# EAGLE design Adafruit QT Py ESP32-S2 uFL (EAGLE 9.6.2)
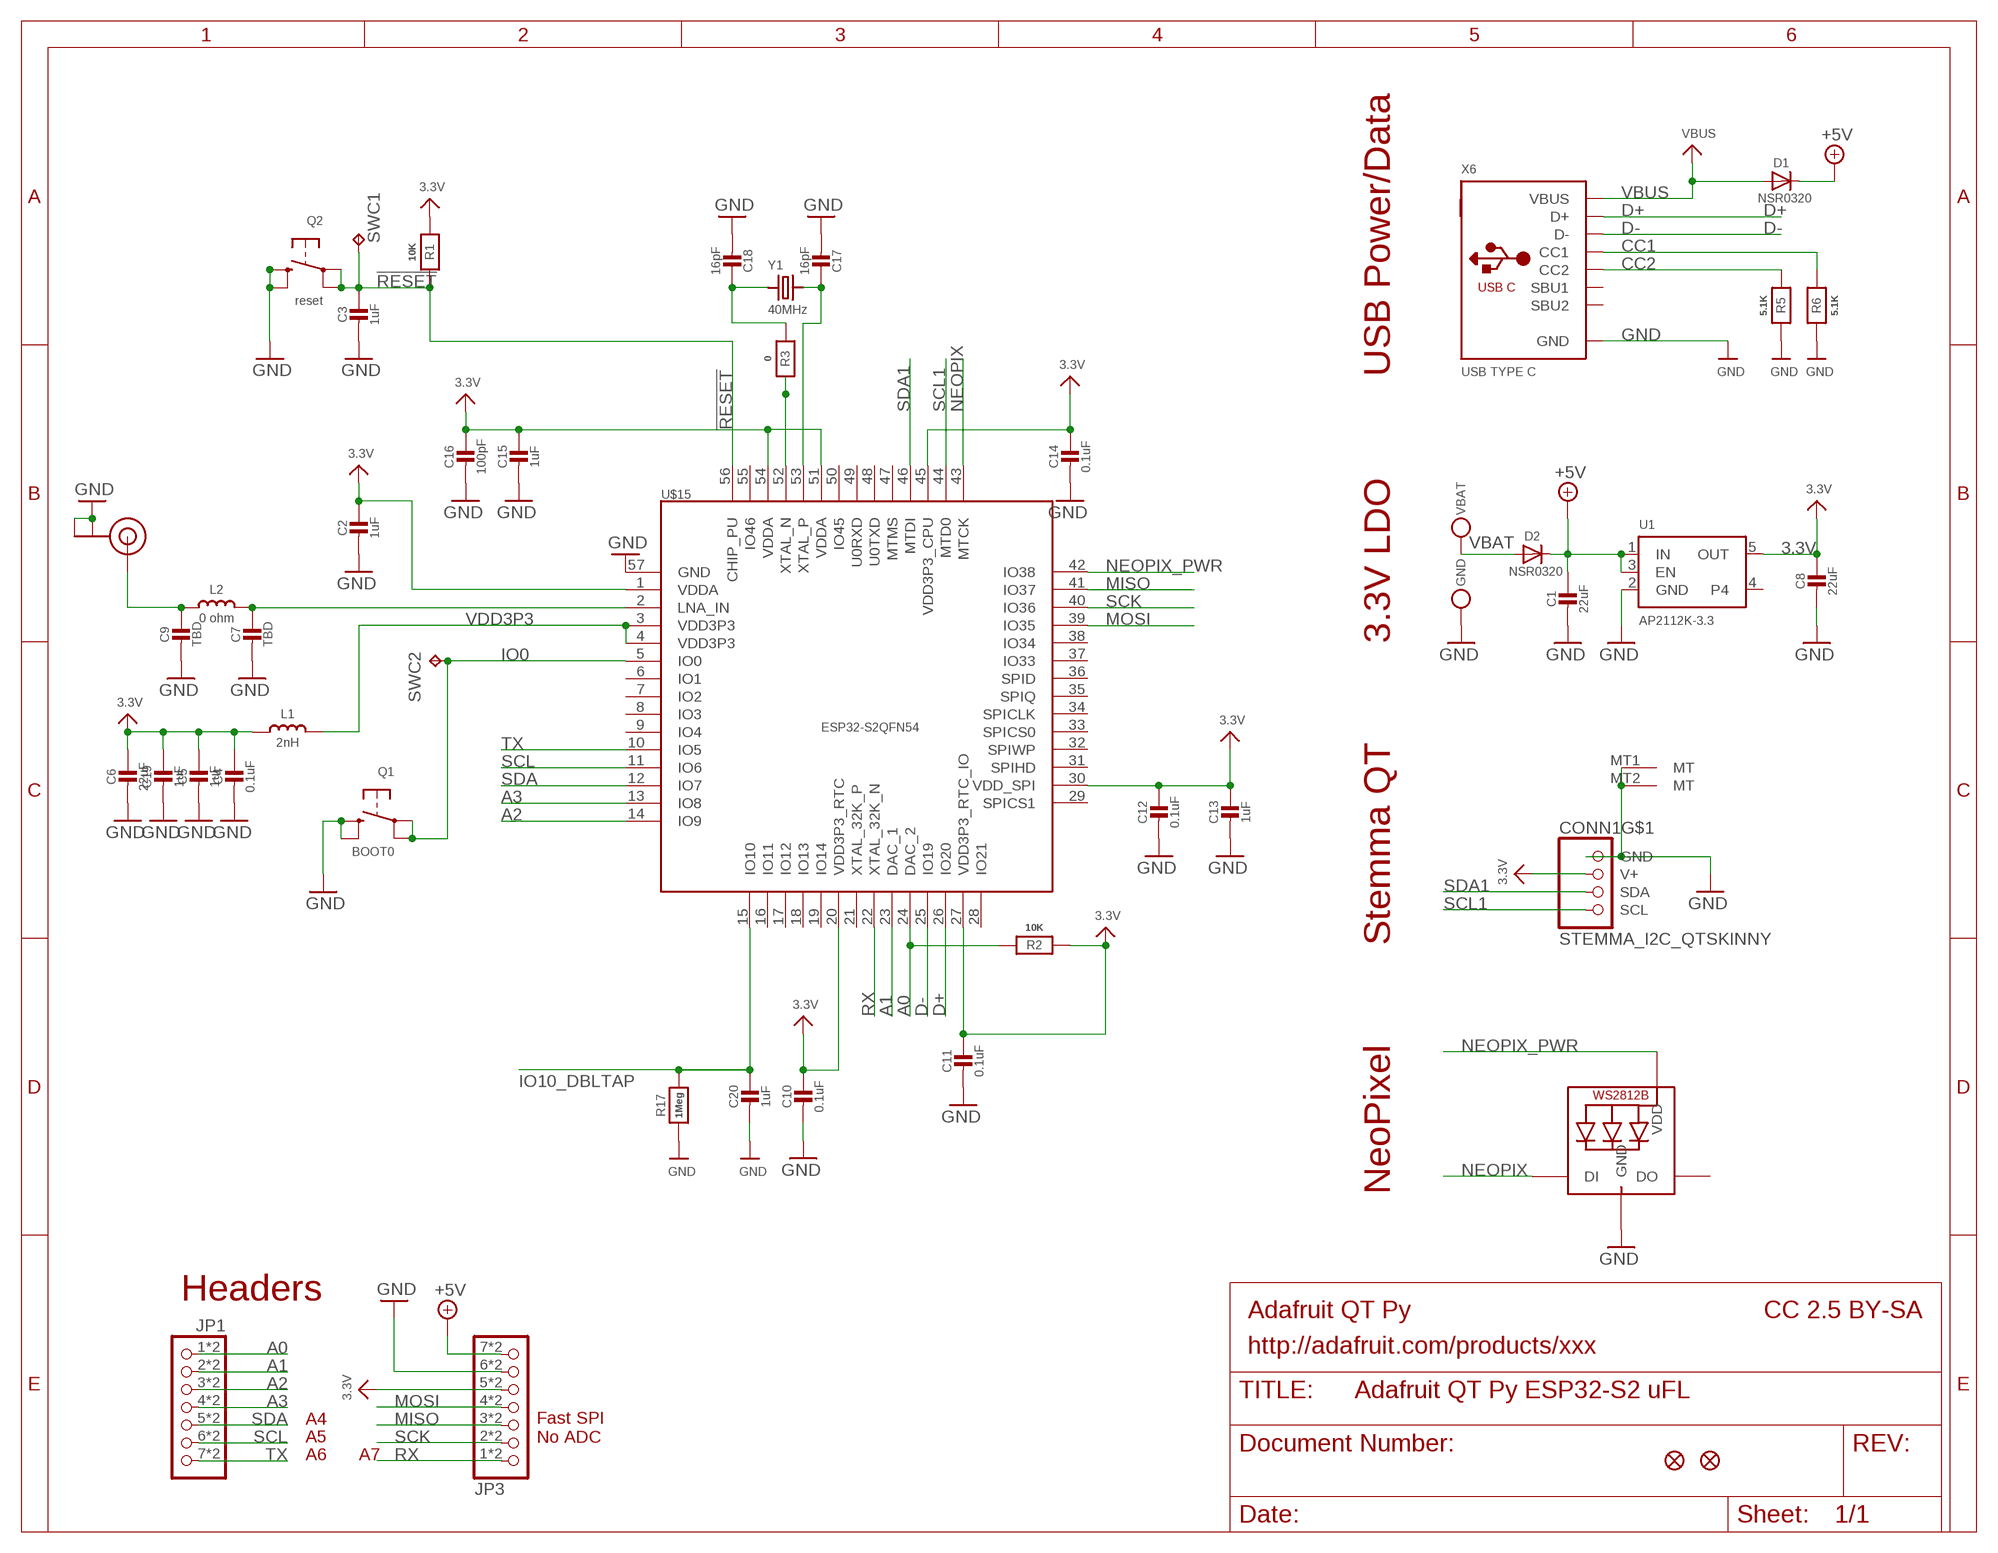
[diagram p0: schematic, sheet 1]

## Parts
C1  22uF  CAP_CERAMIC0805-NOOUTLINE  [0805-NO]
C2  1uF  CAP_CERAMIC_0402NO  [_0402NO]
C3  1uF  CAP_CERAMIC_0402NO  [_0402NO]
C4  0.1uF  CAP_CERAMIC_0402NO  [_0402NO]
C5  1uF  CAP_CERAMIC_0402NO  [_0402NO]
C6  22uF  CAP_CERAMIC0805-NOOUTLINE  [0805-NO]
C7  TBD  CAP_CERAMIC_0402NO  [_0402NO]
C8  22uF  CAP_CERAMIC0805-NOOUTLINE  [0805-NO]
C9  TBD  CAP_CERAMIC_0402NO  [_0402NO]
C10  0.1uF  CAP_CERAMIC_0402NO  [_0402NO]
C11  0.1uF  CAP_CERAMIC_0402NO  [_0402NO]
C12  0.1uF  CAP_CERAMIC_0402NO  [_0402NO]
C13  1uF  CAP_CERAMIC_0402NO  [_0402NO]
C14  0.1uF  CAP_CERAMIC_0402NO  [_0402NO]
C15  1uF  CAP_CERAMIC_0402NO  [_0402NO]
C16  100pF  CAP_CERAMIC_0402NO  [_0402NO]
C17  16pF  CAP_CERAMIC_0402NO  [_0402NO]
C18  16pF  CAP_CERAMIC_0402NO  [_0402NO]
C19  1uF  CAP_CERAMIC_0402NO  [_0402NO]
C20  1uF  CAP_CERAMIC_0402NO  [_0402NO]
CONN1  STEMMA_I2C_QTSKINNY  [JST_SH4_SKINNY]
D1  NSR0320  DIODE_SOD323MINI  [SOD-323_MINI]
D2  NSR0320  DIODE_SOD323MINI  [SOD-323_MINI]
GND  TESTPOINT_1X3  [TESTPOINT_RECT_1X3MM]
JP1  HEADER-1X7_CASTEL  [1X07_CASTEL]
JP3  HEADER-1X7_CASTEL  [1X07_CASTEL]
L1  2nH  INDUCTOR_0402  [_0402]
L2  0 ohm  INDUCTOR_0402  [_0402]
LED1  WS2812B_SK6805_1515  [SK6805_1515]
Q1  BOOT0  SWITCH_TACT_SMT4.6X2.8  [BTN_KMR2_4.6X2.8]
Q2  reset  SWITCH_TACT_SMT4.6X2.8  [BTN_KMR2_4.6X2.8]
R1  10K  RESISTOR_0402NO  [_0402NO]
R2  10K  RESISTOR_0402NO  [_0402NO]
R3  0  RESISTOR_0402NO  [_0402NO]
R5  5.1K  RESISTOR_0402NO  [_0402NO]
R6  5.1K  RESISTOR_0402NO  [_0402NO]
R17  1Meg  RESISTOR_0402NO  [_0402NO]
SWC1  TPB1,27  [B1,27]
SWC2  TPB1,27  [B1,27]
U1  AP2112K-3.3  VREG_SOT23-5  [SOT23-5]
U$6  FIDUCIAL_1MM  [FIDUCIAL_1MM]
U$8  FIDUCIAL_1MM  [FIDUCIAL_1MM]
U$11  U.FL  [U.FL]
U$15  ESP32-S2QFN54  [QFN40P700X700X90-57T400N]
VBAT  TESTPOINT_1X3  [TESTPOINT_RECT_1X3MM]
X6  USB TYPE C  USB_C  [USB_C_CUSB31-CFM2AX-01-X]
Y1  40MHz  CRYSTAL_2X1.6MM  [CRYSTAL_2X1.6]

## Nets
3.3V [power]: C2.1 C4.1 C5.1 C6.1 C8.1 C10.1 C11.1 C12.1 C13.1 C14.1 C15.1 C16.1 C19.1 CONN1.2(V+) JP3.5 JP3.5C L1.1 R1.1 R2.1 U1.5(OUT) U$15.1(VDDA) U$15.20(VDD3P3_RTC) U$15.27(VDD3P3_RTC_IO) U$15.30(VDD_SPI) U$15.45(VDD3P3_CPU) U$15.51(VDDA) U$15.54(VDDA)
!RESET: C3.1 Q2.A'(P1) Q2.A(P) R1.2 SWC1.TP U$15.56(CHIP_PU)
+5V [power]: C1.1 D1.C D2.C JP3.7 JP3.7C U1.1(IN) U1.3(EN)
A0: JP1.1 JP1.1C R2.2 U$15.24(DAC_2)
A1: JP1.2 JP1.2C U$15.23(DAC_1)
A2: JP1.3 JP1.3C U$15.14(IO9)
A3: JP1.4 JP1.4C U$15.13(IO8)
CC1: R6.2 X6.A5(CC1)
CC2: R5.2 X6.B5(CC2)
D+: U$15.26(IO20) X6.A6(D+) X6.B6(D+)
D-: U$15.25(IO19) X6.A7(D-) X6.B7(D-)
GND [power]: C1.2 C2.2 C3.2 C4.2 C5.2 C6.2 C7.2 C8.2 C9.2 C10.2 C11.2 C12.2 C13.2 C14.2 C15.2 C16.2 C17.2 C18.2 C19.2 C20.2 CONN1.1(GND) CONN1.MT1(MT) CONN1.MT2(MT) GND.P$1 JP3.6 JP3.6C LED1.4(GND) Q1.B'(S1) Q1.B(S) Q2.B'(S1) Q2.B(S) R5.1 R6.1 R17.1 U1.2(GND) U$11.P$1(GND) U$11.P$2(GND) U$15.57(GND) X6.A1B12(GND) X6.B1A12(GND)
IO0: Q1.A'(P1) Q1.A(P) SWC2.TP U$15.5(IO0)
IO10_DBLTAP: C20.1 R17.2 U$15.15(IO10)
MISO: JP3.3 JP3.3C U$15.41(IO37)
MOSI: JP3.4 JP3.4C U$15.39(IO35)
N$2: C7.1 L2.2 U$15.2(LNA_IN)
N$3: C9.1 L2.1 U$11.P$3(SIGNAL)
N$5: R3.2 U$15.52(XTAL_N)
N$6: C17.1 U$15.53(XTAL_P) Y1.3
N$7: C18.1 R3.1 Y1.1
NEOPIX: LED1.1(DI) U$15.43(MTCK)
NEOPIX_PWR: LED1.2(VDD) U$15.42(IO38)
RX: JP3.1 JP3.1C U$15.22(XTAL_32K_N)
SCK: JP3.2 JP3.2C U$15.40(IO36)
SCL: JP1.6 JP1.6C U$15.11(IO6)
SCL1: CONN1.4(SCL) U$15.44(MTD0)
SDA: JP1.5 JP1.5C U$15.12(IO7)
SDA1: CONN1.3(SDA) U$15.46(MTDI)
TX: JP1.7 JP1.7C U$15.10(IO5)
VBAT: D2.A VBAT.P$1
VBUS [power]: D1.A X6.A4B9(VBUS) X6.B4A9(VBUS)
VDD3P3: L1.2 U$15.3(VDD3P3) U$15.4(VDD3P3)
Unconnected: LED1.3(DO) U1.4 U$15.6(IO1) U$15.7(IO2) U$15.8(IO3) U$15.9(IO4) U$15.16(IO11) U$15.17(IO12) U$15.18(IO13) U$15.19(IO14) U$15.21(XTAL_32K_P) U$15.28(IO21) U$15.29(SPICS1) U$15.31(SPIHD) U$15.32(SPIWP) U$15.33(SPICS0) U$15.34(SPICLK) U$15.35(SPIQ) U$15.36(SPID) U$15.37(IO33) U$15.38(IO34) U$15.47(MTMS) U$15.48(U0TXD) U$15.49(U0RXD) U$15.50(IO45) U$15.55(IO46) X6.A8(SBU1) X6.B8(SBU2)

## Notes on the sheet
- USB Power/Data
- 3.3V LDO
- Stemma QT
- NeoPixel
- Headers
- Adafruit QT Py | CC 2.5 BY-SA
- http://adafruit.com/products/xxx
- A4
- A5
- Fast SPI
  No ADC
- A6 | A7

## Library data of the parts
C1-C20 = microbuilder:CAP_CERAMIC: Ceramic Capacitors For new designs, use the packages preceded by an '_' character since they are more reliable: The following footprints should be used on most boards: _0402 - Standard footprint for regular board layouts _0603 - Standard footprint for regular board layouts _0805 - Standard footprint for regular board layouts _1206 - Standard footprint for regular board layouts For extremely tight-pitch boards where space is at a premium, the following 'micro-pitch' footprints can be used (smaller pads, no silkscreen outline, etc.): _0402MP - Micro-pitch footprint for very dense/compact boards _0603MP - Micro-pitch footprint for very dense/compact boards _0805MP - Micro-pitch footprint for very dense/compact boards _1206MP - Micro-pitch footprint for very dense/compact boards
CONN1 = microbuilder:STEMMA_I2C
D1 D2 = microbuilder:DIODE: Diode SMA Model Volts Amps Type Vf Ir Digikey # Notes SSA34-E3 40V 3A Schottky 480mV @ 3A 200uA @ 40V SSA34-E3/61TGITR-ND CDBA120-G 20V 1A Schottky 500mV @ 1A 500uA @ 20V 641-1014-6-ND REEL MBRA210 10V 2A Schottky 350mV @ 2A 700uA @ 10V MBRA210LT3 SOD-123 Model Volts Amps Type Vf Ir Order # Notes BAT54T1G 30V 200mA Schottky 800mV @ 200mA 2uA @ 25V BAT54T1GOSTR-ND B0530W 30V 500mA Schottky 430mV @ 500mA 130uA @ 30V B0530W-FDICT-ND REEL MBR120 20V 1A Schottky 340mV @ 1A MBR120VLSFT1GOSCT-ND SOD-323 Model Volts Amps Type Vf Ir Order # Notes PMEG2005EJ 20V 500mA Schottky 355mV @ 500mA 568-4110-1-ND ZLLS410 10V 570mA Schottky 380mV @ 570mA ZLLS410CT-ND 1N4148WS 75V 150mA Silicon/Simple 1V 1N4148WSFSCT-ND REEL SOD-523 Model Volts Amps Type Vf Ir Order # Notes BAT54XV2 30V 200mA Schottky 0.8V @ 100mA BAT54XV2CT-ND TB751S 30V 30mA Schottky RB751S-40TE61CT-ND SOT23-R/W (R = Solder Paste/Reflow Ovens, W = Hand-Soldering) Model Volts Amps Type Vf Ir Order # Notes BAT54FILM 40V 300mA Schottky 497-7162-1-ND POWERDI-5 Model Volts Amps Type Vf Ir Order # Notes PDS560 60V 5A Schottky 670mV @ 5A 150uA @ 60V PDS560DICT-ND
GND VBAT = microbuilder:TESTPOINT: Test Point Various test points for characterisation and PCB testing TESTPOINT_SMT - Compact Surface Mount Test Point [Digikey: 5016KTR-ND]
JP1 JP3 = microbuilder:HEADER-1X7: PIN HEADER
L1 L2 = microbuilder:INDUCTOR: Inductors 0603: 10nH Ceramic Inductor - microwire antenna/RF (Digikey: 712-1434-2-ND) 0805: 560nH Ceramic Inductor - RF (Digikey: 553-1047-1-ND) 270nH Ceramic Inductor - Q = 40@250MHz, +-5%, 1 Ohm DC Resistance (Digikey: 535-10506-2-ND) 1007 (2518 Metric) SMT: 10µH 10% 250mOhm 820mA 1007 Inductor (Digikey: 587-2189-1-ND) 22µH 10% 500mOhm 580mA 1007 Inductor (Digikey: 587-2190-1-ND) 47µH 10% 950mOhm 420mA 1007 Inductor (Digikey: 587-2191-1-ND) 47µH 5% 100mOhm 1A 1008 Inductor (Digikey: 732-1816-1-ND) 5.0x5.0mm (Taiyo Yuden NR5040 Series) 6.8µH 20% 2.3A 64mOhm Inductor (Digikey: 587-2374-2-ND) 5.0x5.0mm (TDK VLC5045 Series) 4.7µH 20% 3.3A 34mOhm Inductor (Digikey: 445-6526-1-ND) 6.8µH 20% 2.7A 46mOhm Inductor (Digikey: 445-6527-1-ND) 6.0x6.0mm (TDK VLC6045 Series) 4.7µH 20% 3.8A 27mOhm Inductor (Digikey: 445-6538-2-ND) 6.8µH 20% 3A 41mOhm Inductor (Digikey: 445-6540-1-ND) 6.2µH 30% 2.2A 45mOhm Inductor (Digikey: SRR5028-6R2YCT-ND) - Not TDK VLC6045 but footprint should match 6.0x6.0mm (TDK SLF6045 Series) 6.8uH 30% 2A 33mOhm Inductor (Digikey: 445-4572-1-ND, Mouser: 810-SLF645T6R8N2R0PF) 6.0x6.0mm (Sumida CDRH5D28 Series) 6.2uH 30% 1.8A 45mOhm Inductor (Digikey: 308-1542-1-ND) Taiyo Yuden NR3015T2R2M - 2.2uH 20% 1.5A (Digikey: 587-1648-2-ND, Mouser: 963-NR3015T2R2M) - Used with TI TPS62172 CoilCraft RFID Transponder Coil - MA5532-AE (For use with AS3935 Lightning Sensor) Taiyo Yuden NRH2412T2R2MNGH - 2.2uH 20% 1AA (Digikey: 587-3443-1-ND) - Used with TI LM3671 Vishay IHLP 1.0uH Molded Inductor - 24mOhm DCR, 5A, +/-20%, -55°C-125°C (Digikey: 541-1319-1-ND)
LED1 = microbuilder:WS2812B
Q1 Q2 = microbuilder:SWITCH_TACT_SMT: SMT Tact Switches 6x6mm - Digikey: P12940SCT-ND KMR2 (4.6x2.8mm) - Digikey: 401-1426-1-ND EVQ-PQHB55 - Light Touch, 160GF (4.5x4.5mm) - Digikey: P8090SCT-ND KMT0 - KMT021 NGJ LHS (etc.) IP68/Waterproof - Digikey: CKN10289CT-ND
R1-R3 R5 R6 R17 = microbuilder:RESISTOR: Resistors For new designs, use the packages preceded by an '_' character since they are more reliable: The following footprints should be used on most boards: _0402 - Standard footprint for regular board layouts _0603 - Standard footprint for regular board layouts _0805 - Standard footprint for regular board layouts _1206 - Standard footprint for regular board layouts For extremely tight-pitch boards where space is at a premium, the following 'micro-pitch' footprints can be used (smaller pads, no silkscreen outline, etc.): _0402MP - Micro-pitch footprint for very dense/compact boards _0603MP - Micro-pitch footprint for very dense/compact boards _0805MP - Micro-pitch footprint for very dense/compact boards _1206MP - Micro-pitch footprint for very dense/compact boards
SWC1 SWC2 = testpad:TP: Test pad
U1 = adafruit_power:VREG_SOT23-5: SOT23-5 Fixed Voltage Regulators Part Current Out V Out V In V Dropout θJA (°C/W) TJ (°C) Digikey Part No. ADP121 150mA 3.3V 3.4-5.5V 0.09V @ 150mA -- -- ADP121-AUJZ33R7CT-ND ADP121 150mA 3.0V 3.1-5.5V 0.09V @ 150mA -- -- ADP121-AUJZ30R7CT-ND ADP122 300mA 3.3V 3.4-5.5V 0.085V @ 300mA -- -- ADP122AUJZ-3.3-R7CT-ND ADP1712 300mA 3.3V 3.5-5.5V 0.17V @ 300mA -- -- ADP1712AUJZ-3.3-R7TR-ND AP7311 (Low Cost) 150mA 3.3V 3.5-6V 0.15V @ 150mA -- -- AP7311-33WG-7DICT-ND LD39015M18R 150mA 1.8V 1.9V-5.5V 0.08V @ 100mA -- -- 497-6977-1-ND LP2985A-33DBVR 150mA 3.3V 3.3-16V 0.28V @ 150mA 206 150 296-18479-1-ND MCP1824T-3302E/OT 300mA 3.3V 3.5V-6V 0.2V @ 300mA -- -- MCP1824T-3302E/OTCT-ND MIC5205-2.5YM5 TR 150mA 2.5V 2.7-16V 0.165V @ 150mA -- -- 576-1257-2-ND MIC5205-3.0YM5 TR 150mA 3.0V 3.2V-16V 0.165V @ 150mA -- -- 576-1258-2-ND MIC5205-3.3YM5 TR 150mA 3.3V 3.5V-16V 0.165V @ 150mA -- -- 576-1259-2-ND TPS780330220 150mA 3.3V+2.2V 3.6-5.5V 250mV Max -- -- 296-23332-1-ND TDA3663/N1,135 100mA 3.3V 3.5-45V 0.18V @ 50mA -- -- 568-5343-1-ND Max operating temp can be calculated using θJA, TJ (max junction temperature), and power in watts. Set the "Maximum Ambient Temperature" until it reaches TJ ("Max Junction Temperature"), which is the absolute limit for safe use of the regulator: Heat Sink Temperature Calculator <http://www.daycounter.com/Calculators/Heat-Sink-Temperature-Calculator.phtml> For example, With 12V source into a 3.3V LP2985 and a 30mA load, we are dissipating (12V-3.3V) * 0.03A = 0.261W. With a θJA of 206 °C/W, a TJ of 150°C, and 261mW we can safely use the chip without a heat sink up to 75°C (=147.1°C Junction Temperature).
U$6 U$8 = microbuilder:FIDUCIAL: Fiducial Alignment Points Various fiducial points for machine vision alignment.; BOM: EXCLUDE
U$11 = SparkFun:U.FL
U$15 = adafruit_wireless:ESP32-S2; DESCRIPTION: WiFi 802.11b/g/n Transceiver Module 2.4GHz Antenna Not Included Surface Mount; DIGI-KEY_PART_NUMBER: 1965-ESP32-S2CT-ND; MF: Espressif Systems; MP: ESP32-S2; PACKAGE: None; PURCHASE-URL: https://pricing.snapeda.com/search/part/ESP32-S2/?ref=eda
X6 = microbuilder:USB_C: USB Type-C USB 2.0 Connector
Y1 = microbuilder:CRYSTAL: Crystals HC49UP - Surface Mount Crystal 4.0MHz 18pF +/-30ppm Surface Mount Crystal [Digikey: 535-9857-1-ND] 12.0 MHz Surface Mount Crystal [Digikey: 535-9869-6-ND] 25.0 MHz Surface Mount Crystal [Digikey: 535-9078-1-ND] 2.5 x 2.0mm - MEMs SMT Crystal 16.0 MHz 10pF 20ppm 2.5 x 2.0mm Crystal [Digikey -40-85°C: 535-10923-1-ND] 3.2 x 2.5mm - MEMs SMT Crystal 12.0 MHz 8pF 15ppm 3.2 x 2.5mm Crystal [Digikey: -10-70°C: 644-1047-1-ND -40-125°C: 644-1128-1-ND] 40~85°C cheaper: 644-1173-6-ND 16.0 MHz 8pF 15ppm 3.2 x 2.5mm Crystal [Digikey: -10-70°C: 644-1049-1-ND -40-125°C: 644-1129-2-ND]-40~85°C cheaper: 644-1175-6-ND 16.0 MHz 10pF 10ppm 3.2 x 2.5mm Crystal [Digikey: 644-1100-1-ND] 27.12 MHz 18pF 30ppm 3.2 x 2.5mm Crystal [Digikey: 887-1424-1-ND] 27.12MHz 10pF 10ppm 3.2 x 2.5mm Crystal [Digikey: 887-1329-1-ND] 4.9 x 1.8mm - MEMs SMT Crystal 32.768 KHz 12.5pF 20ppm 4.9 x 1.8mm Crystal [Digikey: SE2415CT-ND] 8.0 x 3.8mm - Surface Mount Crystal 32.768kHz 12.5pF 20ppm -40°C-85°C [Digikey: 535-9166-2-ND] Cylinder 32.768KHz Cylinder Crystal (2x6mm body) [Ex. Digikey: 300-8341-2-ND]

## Net classes
1 power: width 0.254 mm
2 gnd: width 0.254 mm

## Board
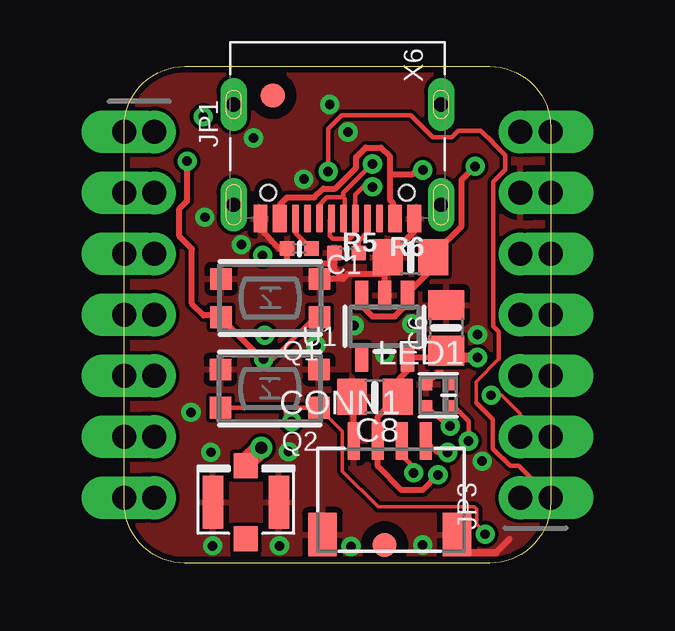
[diagram p1: board, top side]
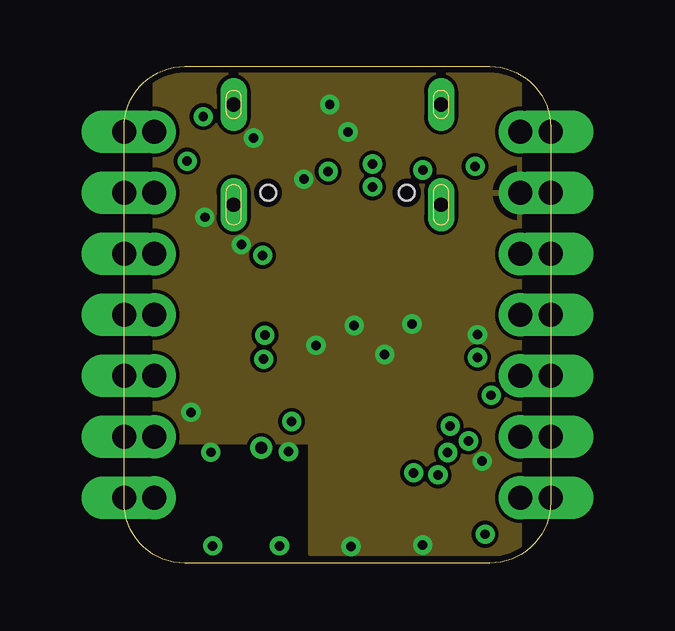
[diagram p2: board, inner layer Route2]
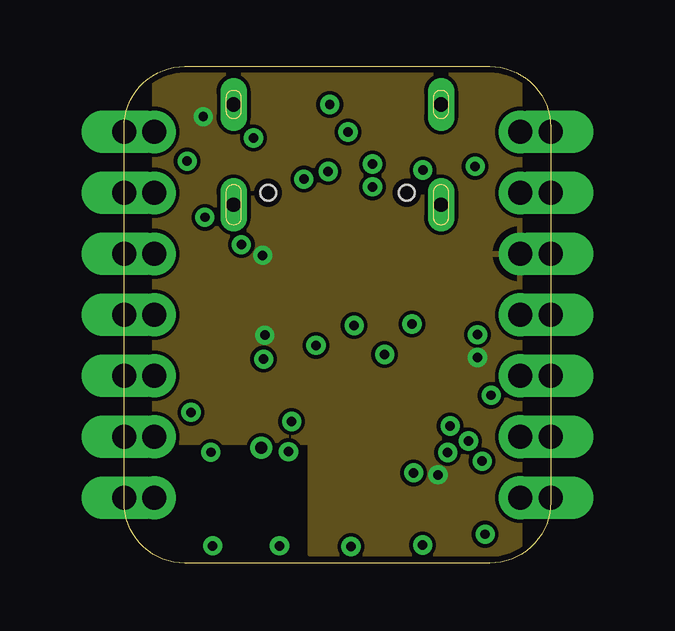
[diagram p3: board, inner layer Route15]
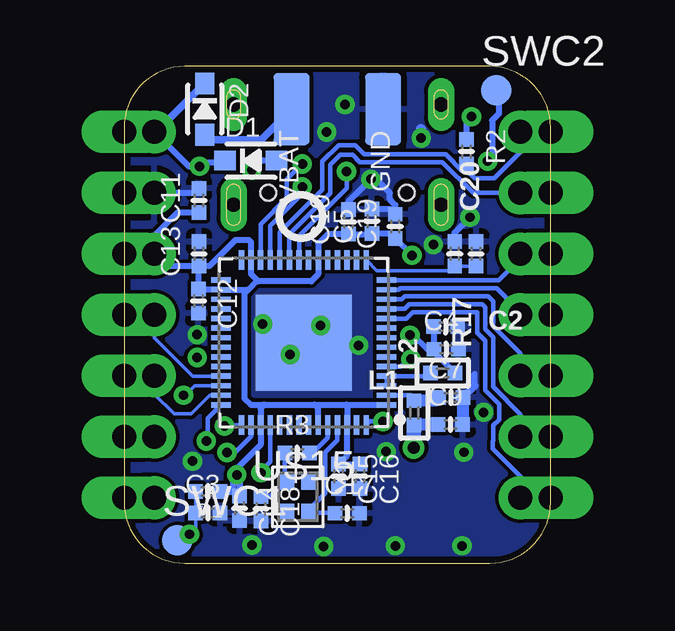
[diagram p4: board, bottom side, seen from below]

Size 17.78 x 20.7 mm. Coordinates in mm from the lower left corner, seen from the top.
Outline: 17.78,18.16 17.78,2.54 arc-90 15.24,0 2.54,0 arc-90 0,2.54 0,18.16 arc-90 2.54,20.7 15.24,20.7 arc-90 17.78,18.16
Copper layers (1+2*15+16): Top 0.035mm / dielectric 0.25mm / Route2 0.035mm / dielectric 0.15mm / Route15 0.035mm / dielectric 0.2mm / Bottom 0.035mm
Design rules "adafruit 6-6 *": minimum track width 6mil, minimum drill 15.5mil, track to track 6mil, track to pad 6mil, pad to pad 6mil, via to via 6mil, smd to smd 6mil, copper to edge 10mil, drill to drill 8mil, minimum pad ring 10mil, minimum via ring 8mil, stop-mask expansion 2mil, vias tented up to drill 20mil, thermal gap 10mil

### Footprints (pad centres in the part's own frame; a part is rotated, then mirrored left to right if it is on the bottom)
0805-NO = smd 1.24 x 1.5: 1 -0.95,0; 2 0.95,0
_0402NO = smd 0.6 x 0.6: 1 -0.508,0; 2 0.508,0
JST_SH4_SKINNY = smd 0.5 x 1.55: 1 -1.5,2.514; 2 -0.5,2.514; 3 0.5,2.514; 4 1.5,2.514 | smd 1.2 x 1.8: MT1 -2.8,-1.386; MT2 2.8,-1.386
SOD-323_MINI = smd 0.9 x 0.8: A 1.07,0; C -1.07,0
TESTPOINT_RECT_1X3MM = smd 3 x 1.5: P$1 0,0
1X07_CASTEL = drill 1 pad 1.778: 1 -7.62,0; 2 -5.08,0; 3 -2.54,0; 4 0,0; 5 2.54,0; 6 5.08,0; 7 7.62,0 | drill 1 pad 1.778 long: 1C -7.62,-1.27; 2C -5.08,-1.27; 3C -2.54,-1.27; 4C 0,-1.27; 5C 2.54,-1.27; 6C 5.08,-1.27; 7C 7.62,-1.27
_0402 = smd 0.6 x 0.6: 1 -0.508,0; 2 0.508,0
SK6805_1515 = smd 0.5 x 0.5: 1 -0.5,-0.45; 2 0.5,-0.45; 3 0.5,0.45; 4 -0.5,0.45
BTN_KMR2_4.6X2.8 = smd 0.9 x 0.9: A 2.05,0.8; A' -2.05,0.8; B 2.05,-0.8; B' -2.05,-0.8
B1,27 = smd 1.27 x 1.27: TP 0,0
SOT23-5 = smd 0.55 x 1.2: 1 -0.95,-1.3; 2 0,-1.3; 3 0.95,-1.3; 4 0.95,1.3; 5 -0.95,1.3
FIDUCIAL_1MM = smd 1 x 1: 1 0,0
U.FL = smd 2.2 x 0.85: P$1 0,1.375; P$2 0,-1.375 | smd 1.05 x 1: P$3 1.525,0; P$4 -1.525,0
QFN40P700X700X90-57T400N = smd 0.81 x 0.22: 1 -3.445,2.6; 2 -3.445,2.2; 3 -3.445,1.8; 4 -3.445,1.4; 5 -3.445,1; 6 -3.445,0.6; 7 -3.445,0.2; 8 -3.445,-0.2; 9 -3.445,-0.6; 10 -3.445,-1; 11 -3.445,-1.4; 12 -3.445,-1.8; 13 -3.445,-2.2; 14 -3.445,-2.6; 29 3.445,-2.6; 30 3.445,-2.2; 31 3.445,-1.8; 32 3.445,-1.4; 33 3.445,-1; 34 3.445,-0.6; 35 3.445,-0.2; 36 3.445,0.2; 37 3.445,0.6; 38 3.445,1; 39 3.445,1.4; 40 3.445,1.8; 41 3.445,2.2; 42 3.445,2.6 | smd 0.22 x 0.81: 15 -2.6,-3.445; 16 -2.2,-3.445; 17 -1.8,-3.445; 18 -1.4,-3.445; 19 -1,-3.445; 20 -0.6,-3.445; 21 -0.2,-3.445; 22 0.2,-3.445; 23 0.6,-3.445; 24 1,-3.445; 25 1.4,-3.445; 26 1.8,-3.445; 27 2.2,-3.445; 28 2.6,-3.445; 43 2.6,3.445; 44 2.2,3.445; 45 1.8,3.445; 46 1.4,3.445; 47 1,3.445; 48 0.6,3.445; 49 0.2,3.445; 50 -0.2,3.445; 51 -0.6,3.445; 52 -1,3.445; 53 -1.4,3.445; 54 -1.8,3.445; 55 -2.2,3.445; 56 -2.6,3.445 | smd 4 x 4: 57 0,0
USB_C_CUSB31-CFM2AX-01-X = smd 0.575 x 1.15: A1B12 -3.2,3.545; A4B9 -2.4,3.545; B1A12 3.2,3.545; B4A9 2.4,3.545 | smd 0.275 x 1.15: A5 -1.25,3.545; A6 -0.25,3.545; A7 0.25,3.545; A8 1.25,3.545; B5 1.75,3.545; B6 0.75,3.545; B7 -0.75,3.545; B8 -1.75,3.545 | drill 0.6 pad 1 long: M1 -4.32,2.97; M2 4.32,2.97; M3 -4.32,-1.21; M4 4.32,-1.21 | hole 0.65: 2.89,2.47; -2.89,2.47
CRYSTAL_2X1.6 = smd 0.75 x 0.7: 1 -0.675,-0.5; 2 0.675,-0.5; 3 0.675,0.5; 4 -0.675,0.5

### Placement (x,y rotation side)
C1  11.94,12.74 180 top
C2  4.38,9.86 0 bottom
C3  14.29,2.1 0 bottom
C4  4.36,8.92 0 bottom
C5  7.45,14.25 90 bottom
C6  13.42,9.8 90 top
C7  4.17,6.91 0 bottom
C8  10.45,6.93 180 top
C9  4.18,5.78 0 bottom
C10  8.43,14.22 90 bottom
C11  14.66,15.11 90 bottom
C12  14.68,10.92 270 bottom
C13  14.66,12.89 90 bottom
C14  12.97,2.29 270 bottom
C15  8.84,3.62 270 bottom
C16  7.95,3.62 270 bottom
C17  8.48,2.08 0 bottom
C18  12.08,2.26 270 bottom
C19  6.48,14.03 90 bottom
C20  3.11,12.89 90 bottom
CONN1  11.07,2.58 0 top
D1  12.5,16.78 0 bottom
D2  14.41,18.92 270 bottom
GND  6.99,18.92 270 bottom
JP1  1.27,10.35 270 top
JP3  16.51,10.35 90 top
L1  4.5,7.92 180 bottom
L2  5.69,6.26 90 bottom
LED1  13.09,7 0 top
Q1  6.1,11.05 180 top
Q2  6.07,7.28 180 top
R1  14.29,2.98 180 bottom
R2  3.51,17.14 270 bottom
R3  10.57,4.58 0 bottom
R5  7.3,13.11 0 top
R6  9.27,12.93 0 top
R17  4,12.89 270 bottom
SWC1  15.56,0.95 0 bottom
SWC2  2.26,19.7 0 bottom
U1  10.86,9.87 180 top
U$6  6.2,19.49 0 top
U$7  [QTPYS2_BOT]  17.78,0 0 bottom
U$8  10.86,0.76 0 top
U$11  5.08,2.54 90 top
U$12  [PCBFEAT-REV-040]  10.41,14.45 0 bottom
U$13  [QTPYS2UFL_TOP]  0,-0.01 0 top
U$15  10.29,9.19 180 bottom
VBAT  10.79,18.92 270 bottom
X6  8.89,17.91 180 top
Y1  10.54,2.77 270 bottom

### Tracks (layer width: path | path; a pad name or v marks a point on that pad's centre or on a via)
3.3V  (via drill 0.39)
  Top 0.254: CONN1.2 10.57,5.6 | v13.08,3.68 12.45,3.05 11.56,3.05 10.57,4.03 CONN1.2 | CONN1.2 10.57,6.11 C8.1 11.5,6.9 11.5,7.31 11.47,7.69 11.81,8.02 U1.5 13.14,8.57 C6.1
  Top 0.406: C6.1 13.71,8.57 v14.73,8.57
  Bottom 0.254: C16.1 C15.1 8.49,4.48 U$15.54 8.49,6.58 | U$15.1 8.47,6.59 8.49,6.58 | 13.22,3.37 13.22,2.98 R1.1 | 13.22,3.37 13.22,3.8 12.09,4.93 U$15.45 12.09,6.46 11.94,6.6 | v13.08,3.68 12.97,3.57 C14.1 12.97,3.37 13.22,3.37 | JP3.5C 16.64,12.89 | 16.64,12.89 JP3.5 16.51,13.65 15.56,14.61 C11.1 | C13.1 16.13,12.38 16.64,12.89 | 14.59,11.39 U$15.30 12.61,11.39 | C4.1 4.86,8.8 L1.1 | v5.87,9.5 5.74,9.5 5.15,8.91 C4.1 | C13.1 14.22,12.38 13.14,13.46 12.57,13.46 12.49,13.38 U$15.27 12.49,12.04 12.22,11.78 | C13.1 14.68,12.36 C12.1 | 12.22,11.78 12.19,11.75 9.97,11.75 9.69,12.03 U$15.20 9.69,13.31 9.28,13.72 C10.1 7.48,13.72 C5.1 6.69,13.74 C19.1 v5.78,12.83 | 11.94,6.6 12.51,6.6 12.76,6.86 12.76,11.24 12.61,11.39 | 12.61,11.39 12.22,11.78 | C2.1 4.86,9.83 C4.1 | 8.49,6.58 8.51,6.6 9.84,6.6 | 11.94,6.6 9.84,6.6 | U$15.51 9.69,6.45 9.84,6.6 | R2.1 3.5,18.4 v3.3,18.61
  pour Route15: 1.27,5.02 7.75,5.02 7.75,0.38 16.51,0.38 16.51,20.7 1.27,20.7
!RESET  (via drill 0.39)
  Top 0.152: Q2.A' 9.1,5.5 9.1,3.84 10.59,2.35 14.6,2.35 14.7,2.25 14.7,1.62 15.05,1.27 v15.05,1.21
  Top 0.178: Q2.A' 6.73,6.48 | 6.73,6.48 Q2.A | v6.99,5.91 6.99,5.97 6.73,6.22 6.73,6.48
  Bottom 0.152: R1.2 C3.1 14.8,1.46 v15.05,1.21
  Bottom 0.178: U$15.56 7.53,5.91 v6.99,5.91 | v15.05,1.21 15.3,1.21 SWC1.TP
+5V  (via drill 0.39)
  Top 0.254: U1.3 9.91,10.73 10.35,10.29 11.29,10.29 11.68,10.68 11.68,11.04 U1.1 11.81,11.24 13.25,12.68 C1.1 12.93,12.91 14.07,14.05 14.07,15.97 v14.63,16.54
  Bottom 0.254: 17.14,17.97 17.4,17.97 JP3.7C | JP3.7 16.41,17.88 15.08,16.54 v14.63,16.54 14.57,16.54 14.39,16.71 13.63,16.71 D1.C
  Bottom 0.305: D2.C 16.41,17.99 16.41,17.88 | JP3.7 17.14,17.97
A0
  Bottom 0.178: JP1.1 1.27,17.13 2.36,16.05 3.17,16.05 3.49,16.36 | U$15.24 11.29,13.78 9.51,15.56 9.51,16.74 8.84,17.41 8.14,17.41 7.77,17.04 4.38,17.04 3.7,16.36 3.49,16.36 | R2.2 3.5,16.38 3.49,16.36
  Bottom 0.254: JP1.1C JP1.1
A1
  Bottom 0.178: JP1.2 3.24,15.43 4.52,16.71 7.95,16.71 8.26,17.02 8.76,17.02 9.18,16.6 9.18,15.42 10.89,13.71 U$15.23
  Bottom 0.254: JP1.2C JP1.2
A2
  Bottom 0.178: U$15.14 2.17,11.79 1.27,12.7 JP1.3
  Bottom 0.254: JP1.3C JP1.3
A3
  Bottom 0.178: U$15.13 6.33,11.39 6.27,11.46 2.25,11.46 1.14,10.35
  Bottom 0.254: JP1.4C 1.14,10.35 JP1.4
CC1
  Top 0.178: X6.A5 10.14,13.79 9.78,13.42 R6.2
CC2
  Top 0.178: X6.B5 7.14,13.78 R5.2
D+  (via drill 0.39)
  Top 0.178: X6.A6 9.2,14.43 9.2,15.18 9.14,15.24 | X6.B6 8.14,14.92 8.46,15.24 9.14,15.24 | 9.14,15.24 9.14,15.43 v10.35,16.64
  Bottom 0.178: U$15.26 12.09,14.12 10.99,15.22 10.99,16 v10.35,16.64
D-  (via drill 0.39)
  Top 0.178: v10.35,15.68 10.16,15.88 9.64,15.36 X6.B7 9.64,13.77 9.4,13.53 8.7,13.53 8.58,13.65 8.58,14.3 X6.A7
  Bottom 0.178: U$15.25 11.69,14.05 10.35,15.39 v10.35,15.68
GND  (via drill 0.39)
  Top 0.254: 15.49,0.45 16.07,1.02 | X6.B1A12 5.69,13.89 6.48,13.11 R5.1 6.79,12.48 8.76,12.48 R6.1 | 8.76,12.36 8.7,12.29 8.72,12.29 9.14,11.87 | U1.2 10.86,12.05 9.32,12.05 9.14,11.87 | Q1.B' 9.12,11.85 9.14,11.87 | 9.57,4.95 CONN1.1 9.57,6.86 C8.2 | X6.A1B12 12.09,13.84 C1.2 | LED1.4 13.08,7.94 13.19,7.94 13.2,7.95
  Top 0.305: 13.87,0.99 14.43,0.45 15.49,0.45
  Top 0.406: CONN1.MT2 13.87,0.99
  Bottom 0.254: C9.2 3.66,5.79 | JP3.6C 14.66,15.43 C11.2 | 3.17,7.39 3.17,7.87 | C5.2 6.69,14.76 C19.2 6.48,14.92 6.71,15.14 6.71,15.43 7.28,16 v7.49,16 8.43,15.06 C10.2 | R17.1 4,13.77 3.74,14.04 v3.37,14.41
  Bottom 0.305: C7.2 3.17,7.39
  Bottom 0.406: 5.4,18.1 v5.4,17.72
  Bottom 0.508: C7.2 3.66,5.79
  other vias: 9.59,9.91 12.45,0.76 8.57,19.11 14.73,9.53 2.79,6.29 12,9.97 10.86,8.7 4.89,13.27 8,9.08 9.46,0.7 14.92,4.25 9.33,17.97 6.86,4.65 3.62,4.62 3.7,0.72 6.48,0.72
  pour Top: 0,0.38 17.78,0.38 17.78,20.7 0,20.7
  pour Bottom: 0,0.38 17.78,0.38 17.78,20.7 0,20.7
  pour Route2: 1.27,20.7 16.51,20.7 16.51,0.38 7.75,0.38 7.75,5.02 1.27,5.02
IO0  (via drill 0.39)
  Top 0.178: 7.95,10.25 6.2,8.5 v5.82,8.5
  Top 0.254: 7.95,10.25 Q1.A' | v5.82,8.5 5.76,8.5 4.05,10.21 Q1.A 3.97,10.32 3.32,10.32 2.83,10.81 2.83,13.1 2.31,13.62 2.31,14.78 2.63,15.1 v2.63,16.75
  Bottom 0.178: v5.82,8.5 5.95,8.5 6.25,8.2 U$15.5
  Bottom 0.254: SWC2.TP 2.16,19.6 2.16,18.73 2.44,18.45 2.44,16.94 v2.63,16.75
IO10_DBLTAP
  Bottom 0.152: C20.1 R17.2 4.29,12.19 7.24,12.19 U$15.15
MISO
  Bottom 0.152: U$15.41 14.21,7 14.99,6.22 15.68,6.22 16.51,7.05 JP3.3 JP3.3C
MOSI
  Bottom 0.152: U$15.39 14.91,7.79 16.51,9.4 JP3.4
  Bottom 0.254: JP3.4C JP3.4
N$2
  Bottom 0.178: U$15.2 5.82,7 L2.2 5.68,6.78
  Bottom 0.508: 5.68,6.78 4.8,6.78 C7.1
N$3  (via drill 0.5)
  Top 0.813: U$11.P$3 5.08,4.18 v5.71,4.81
  Bottom 0.178: L2.1 5.66,5.78
  Bottom 0.406: L2.1 5.71,5.75
  Bottom 0.508: C9.1 5.66,5.78
  Bottom 0.61: 5.71,5.75 v5.71,4.81
N$5
  Bottom 0.178: U$15.52 9.29,5.23 9.93,4.58 R3.2
N$6
  Bottom 0.178: U$15.53 8.89,5.13 9.4,4.62 9.4,2.92 10.04,2.28 Y1.3 9.13,2.09 C17.1
N$7
  Bottom 0.178: R3.1 11.07,3.48 Y1.1 11.72,2.77 C18.1
NEOPIX  (via drill 0.39)
  Top 0.178: v13.59,5.71 13.5,5.71 LED1.1
  Bottom 0.178: U$15.43 13.55,5.75 v13.59,5.71
NEOPIX_PWR  (via drill 0.39)
  Top 0.178: v14.35,5.09 v14.36,5.1 14.36,5.91 13.61,6.66 LED1.2
  Bottom 0.178: U$15.42 14.29,6.04 14.29,5.15 v14.35,5.09
RX  (via drill 0.39)
  Top 0.152: 14.67,6.7 14.67,7.56 15.62,8.51
  Top 0.178: JP3.1C 16.45,4.06 16.08,4.06 15.37,4.77 15.37,5.99 14.67,6.7 | 15.62,8.51 15.62,9.64 15.38,9.88 15.38,15.9 15.88,16.39 15.88,17.01 15.38,17.5 15.38,17.51 14.87,18.02 13.92,18.02 13.65,17.75 12.86,17.75 11.94,18.67 9.08,18.67 8.51,18.1 v8.51,16.32
  Bottom 0.178: v8.51,16.32 8.51,15.63 10.49,13.65 U$15.22
  Bottom 0.254: JP3.1C JP3.1
SCK  (via drill 0.39)
  Top 0.152: v15.3,7 15.74,7 16.51,6.23 JP3.2
  Bottom 0.152: v15.3,7 15.23,7 14.84,7.39 U$15.40
  Bottom 0.254: JP3.2C JP3.2
SCL
  Bottom 0.178: U$15.11 6.08,10.6 5.89,10.79 2.86,10.79 2.73,10.66 2.73,9.75 2.4,9.41 2.4,7.34 1.27,6.21 JP1.6
  Bottom 0.254: JP1.6C JP1.6
SCL1  (via drill 0.39)
  Top 0.178: CONN1.4 13.05,4.61 v13.48,4.61
  Bottom 0.178: v13.48,4.61 13.17,4.61 12.49,5.29 U$15.44
SDA
  Bottom 0.178: U$15.12 6.21,10.99 6.08,11.12 2.6,11.12 2.4,10.92 2.4,9.88 1.27,8.75 JP1.5
  Bottom 0.254: JP1.5C JP1.5
SDA1  (via drill 0.39)
  Top 0.178: CONN1.3 11.57,4.5 12.07,4.01 v12.07,3.77
  Bottom 0.178: U$15.46 11.7,4.24 12.07,3.86 v12.07,3.77
TX
  Bottom 0.178: 0.38,2.73 2.41,4.76 2.41,5.08 2.4,5.09 2.4,5.74 2.15,5.99 2.15,6.63 2.73,7.21 2.73,9.28 3.06,9.61 3.06,10.46 5.75,10.46 6.01,10.2 U$15.10
  Bottom 0.254: JP1.7C 0.38,2.73 JP1.7
VBAT
  Bottom 0.305: VBAT.P$1 12.06,17.65 14.21,17.65 D2.A
VBUS  (via drill 0.39)
  Top 0.254: X6.A4B9 11.14,14.51 11.2,14.57 11.2,15.01 11.07,15.14 11.07,16.19 | X6.B4A9 6.49,14.93 6.8,15.24 7.94,15.24 8.3,15.61 8.8,15.61 9.67,16.48 9.67,16.92 10.07,17.32 10.71,17.32 11.07,16.95 11.07,16.19 | v12.45,16.38 12.2,16.38 12.01,16.19 11.07,16.19
  Bottom 0.254: D1.A 12.06,16.78 v12.45,16.38
VDD3P3
  Bottom 0.178: U$15.3 U$15.4 5.13,7.8 L1.2